# Altium schematic sheet Flight Control Board.SchDoc
size A1
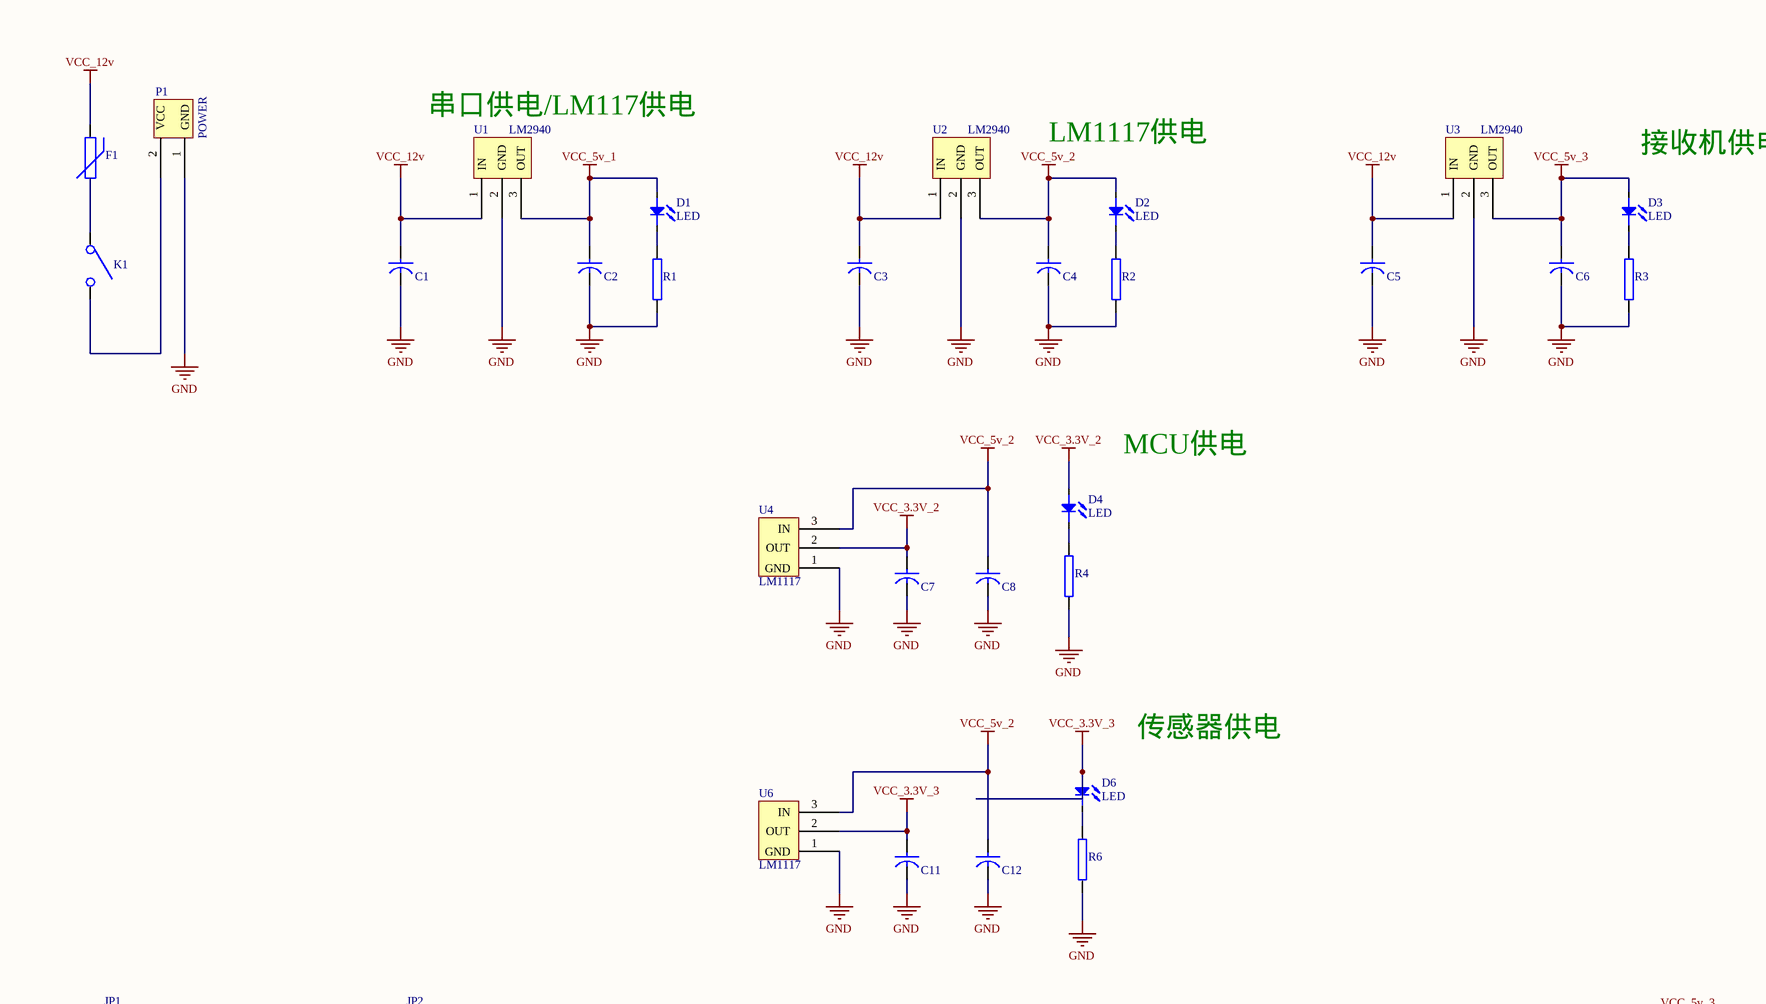
[diagram p0: Flight Control Board.SchDoc, top left]
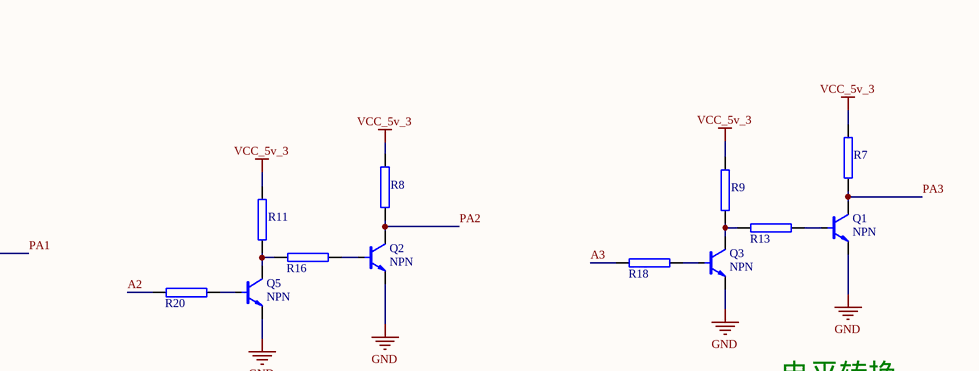
[diagram p1: Flight Control Board.SchDoc, top right]
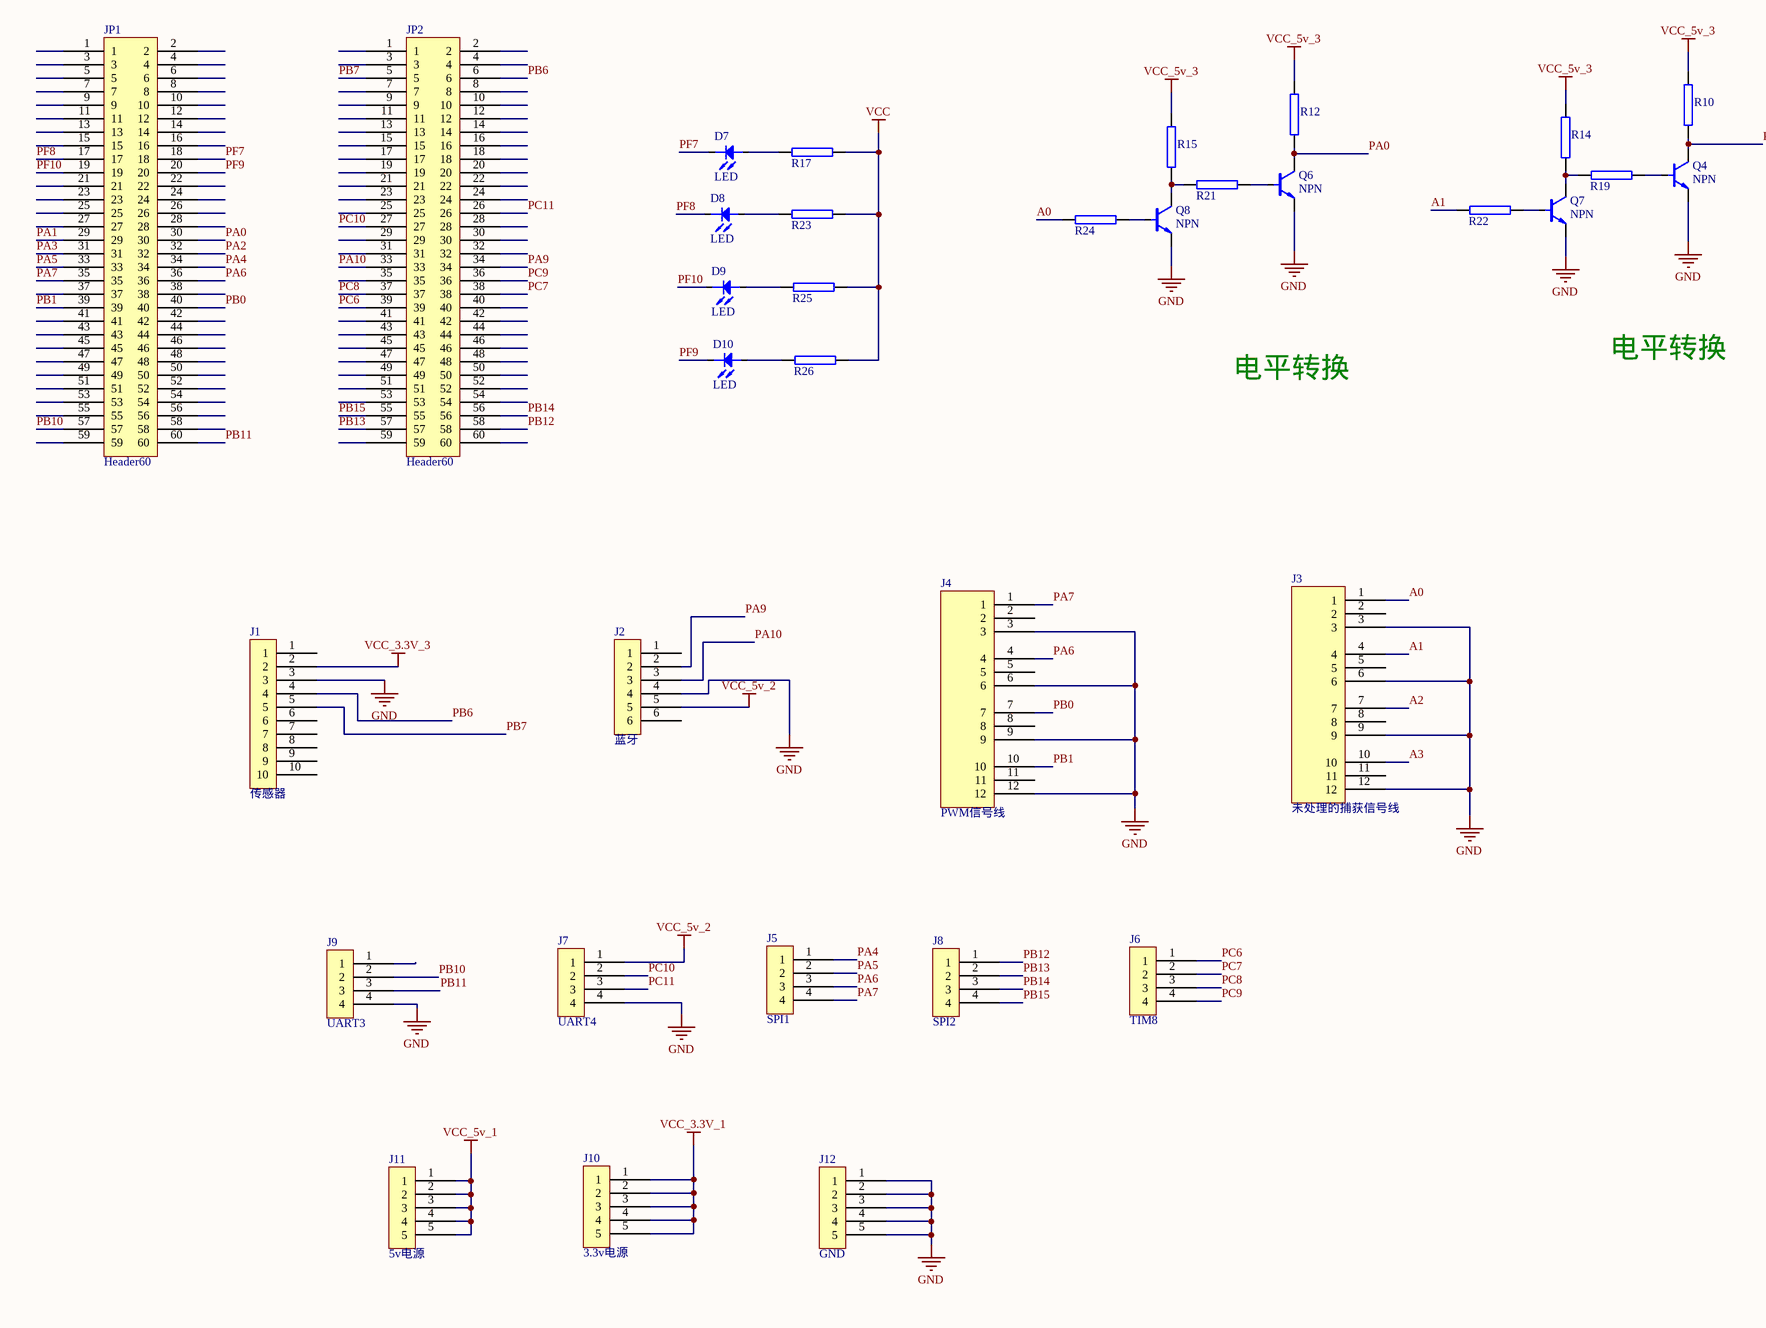
[diagram p2: Flight Control Board.SchDoc, bottom left]
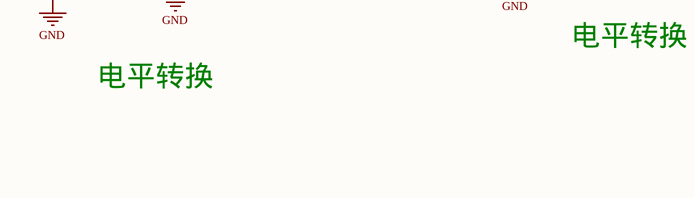
[diagram p3: Flight Control Board.SchDoc, bottom right]

## Parts
C1  CAP_C  [CAP_C]  (value not drawn)
C2  CAP_C  [CAP_C]  (value not drawn)
C3  CAP_C  [CAP_C]  (value not drawn)
C4  CAP_C  [CAP_C]  (value not drawn)
C5  CAP_C  [CAP_C]  (value not drawn)
C6  CAP_C  [CAP_C]  (value not drawn)
C7  CAP_C  [CAP_C]  (value not drawn)
C8  CAP_C  [CAP_C]  (value not drawn)
C11  CAP_C  [CAP_C]  (value not drawn)
C12  CAP_C  [CAP_C]  (value not drawn)
D1  LED  [LED]
D2  LED  [LED]
D3  LED  [LED]
D4  LED  [LED]
D6  LED  [LED]
D7  LED  [LED]
D8  LED  [LED]
D9  LED  [LED]
D10  LED  [LED]
F1  FUSE  [FUSE]  (value not drawn)
J1  传感器  [Header10]
J2  蓝牙  [Header6]
J3  未处理的捕获信号线  [Header4*3]
J4  PWM信号线  [Header4*3]
J5  SPI1  [Header4]
J6  TIM8  [Header4]
J7  UART4  [Header4]
J8  SPI2  [Header4]
J9  UART3  [Header4]
J10  3.3v电源  [Header5]
J11  5v电源  [Header5]
J12  GND  [Header5]
JP1  Header60  [Header60]
JP2  Header60  [Header60]
K1  KEY  [KEY]  (value not drawn)
P1  POWER  [POWER]
Q1  NPN  [NPN]
Q2  NPN  [NPN]
Q3  NPN  [NPN]
Q4  NPN  [NPN]
Q5  NPN  [NPN]
Q6  NPN  [NPN]
Q7  NPN  [NPN]
Q8  NPN  [NPN]
R1  RES  [LED]  (value not drawn)
R2  RES  [LED]  (value not drawn)
R3  RES  [LED]  (value not drawn)
R4  RES  [LED]  (value not drawn)
R6  RES  [LED]  (value not drawn)
R7  RES  [LED]  (value not drawn)
R8  RES  [LED]  (value not drawn)
R9  RES  [LED]  (value not drawn)
R10  RES  [LED]  (value not drawn)
R11  RES  [LED]  (value not drawn)
R12  RES  [LED]  (value not drawn)
R13  RES  [LED]  (value not drawn)
R14  RES  [LED]  (value not drawn)
R15  RES  [LED]  (value not drawn)
R16  RES  [LED]  (value not drawn)
R17  RES  [LED]  (value not drawn)
R18  RES  [LED]  (value not drawn)
R19  RES  [LED]  (value not drawn)
R20  RES  [LED]  (value not drawn)
R21  RES  [LED]  (value not drawn)
R22  RES  [LED]  (value not drawn)
R23  RES  [LED]  (value not drawn)
R24  RES  [LED]  (value not drawn)
R25  RES  [LED]  (value not drawn)
R26  RES  [LED]  (value not drawn)
U1  LM2940  [2940]
U2  LM2940  [2940]
U3  LM2940  [2940]
U4  LM1117  [1117]
U6  LM1117  [1117]

## Nets
GND: C1.2 C2.2 C3.2 C4.2 C5.2 C6.2 C7.2 C8.2 C11.2 C12.2 J1.3 J2.4 J3.3 J3.6 J3.9 J3.12 J4.3 J4.6 J4.9 J4.12 J7.4 J9.4 J12.1 J12.2 J12.3 J12.4 J12.5 P1.1(GND) Q1.E(e) Q2.E(e) Q3.E(e) Q4.E(e) Q5.E(e) Q6.E(e) Q7.E(e) Q8.E(e) R1.1 R2.1 R3.1 R4.1 R6.1 U1.2(GND) U2.2(GND) U3.2(GND) U4.1(GND) U6.1(GND)
VCC: R17.1 R23.1 R25.1 R26.1
VCC_3.3V_1: J10.1 J10.2 J10.3 J10.4 J10.5
VCC_3.3V_2: C7.1 D4.1 U4.2(OUT)
VCC_3.3V_3: C11.1 D6.1 J1.2 U6.2(OUT)
VCC_5v_1: C2.1 D1.1 J11.1 J11.2 J11.3 J11.4 J11.5 U1.3(OUT)
VCC_5v_2: C4.1 C8.1 C12.1 D2.1 J2.5 J7.1 U2.3(OUT) U4.3(IN) U6.3(IN)
VCC_5v_3: C6.1 D3.1 R7.1 R8.1 R9.1 R10.1 R11.1 R12.1 R14.1 R15.1 U3.3(OUT)
VCC_12v: C1.1 C3.1 C5.1 F1.1 U1.1(IN) U2.1(IN) U3.1(IN)
A0: J3.1 R24.2
A1: J3.4 R22.2
A2: J3.7 R20.2
A3: J3.10 R18.2
PA0: JP1.30 Q6.C(c) R12.2
PA1: JP1.29 Q4.C(c) R10.2
PA2: JP1.32 Q2.C(c) R8.2
PA3: JP1.31 Q1.C(c) R7.2
PA4: J5.1 JP1.34
PA5: J5.2 JP1.33
PA6: J4.4 J5.3 JP1.36
PA7: J4.1 J5.4 JP1.35
PA9: J2.2 JP2.34
PA10: J2.3 JP2.33
PB0: J4.7 JP1.40
PB1: J4.10 JP1.39
PB6: J1.4 JP2.6
PB7: J1.5 JP2.5
PB10: J9.2 JP1.57
PB11: J9.3 JP1.60
PB12: J8.1 JP2.58
PB13: J8.2 JP2.57
PB14: J8.3 JP2.56
PB15: J8.4 JP2.55
PC6: J6.1 JP2.39
PC7: J6.2 JP2.38
PC8: J6.3 JP2.37
PC9: J6.4 JP2.36
PC10: J7.2 JP2.27
PC11: J7.3 JP2.26
PF7: D7.2 JP1.18
PF8: D8.2 JP1.17
PF9: D10.2 JP1.20
PF10: D9.2 JP1.19
NetD1_2: D1.2 R1.2
NetD2_2: D2.2 R2.2
NetD3_2: D3.2 R3.2
NetD4_2: D4.2 R4.2
NetD6_2: D6.2 R6.2
NetD7_1: D7.1 R17.2
NetD8_1: D8.1 R23.2
NetD9_1: D9.1 R25.2
NetD10_1: D10.1 R26.2
NetF1_2: F1.2 K1.1
NetK1_2: K1.2 P1.2(VCC)
NetQ1_B: Q1.B(b) R13.2
NetQ2_B: Q2.B(b) R16.2
NetQ3_B: Q3.B(b) R18.1
NetQ3_C: Q3.C(c) R9.2 R13.1
NetQ4_B: Q4.B(b) R19.2
NetQ5_B: Q5.B(b) R20.1
NetQ5_C: Q5.C(c) R11.2 R16.1
NetQ6_B: Q6.B(b) R21.2
NetQ7_B: Q7.B(b) R22.1
NetQ7_C: Q7.C(c) R14.2 R19.1
NetQ8_B: Q8.B(b) R24.1
NetQ8_C: Q8.C(c) R15.2 R21.1

Not connected (* = marked no-connect by the designer): J1 1 6 7 8 9 10; J2 1 6; J3 2 5 8 11; J4 2 5 8 11; J9 1; JP1 1 2 3 4 5 6 7 8 9 10 11 12 13 14 15 16 21 22 23 24 25 26 27 28 37 38 41 42 43 44 45 46 47 48 49 50 51 52 53 54 55 56 58 59; JP2 1 2 3 4 7 8 9 10 11 12 13 14 15 16 17 18 19 20 21 22 23 24 25 28 29 30 31 32 35 40 41 42 43 44 45 46 47 48 49 50 51 52 53 54 59 60

## Notes on the sheet
- 串口供电/LM117供电
- LM1117供电
- (near D3) 接收机供电
- MCU供电
- 传感器供电
- 电平转换
- Title
- Size:
- Date:
- File:
- A1
- Number:
- Time:
- Revision:
- Sheet
- of

## Library data of the parts
J1 = Header10
J2 = Header6
J3 J4 = Header4*3
J5-J9 = Header4
J10-J12 = Header5